# Altium schematic sheet Interface Section.SchDoc
size A3
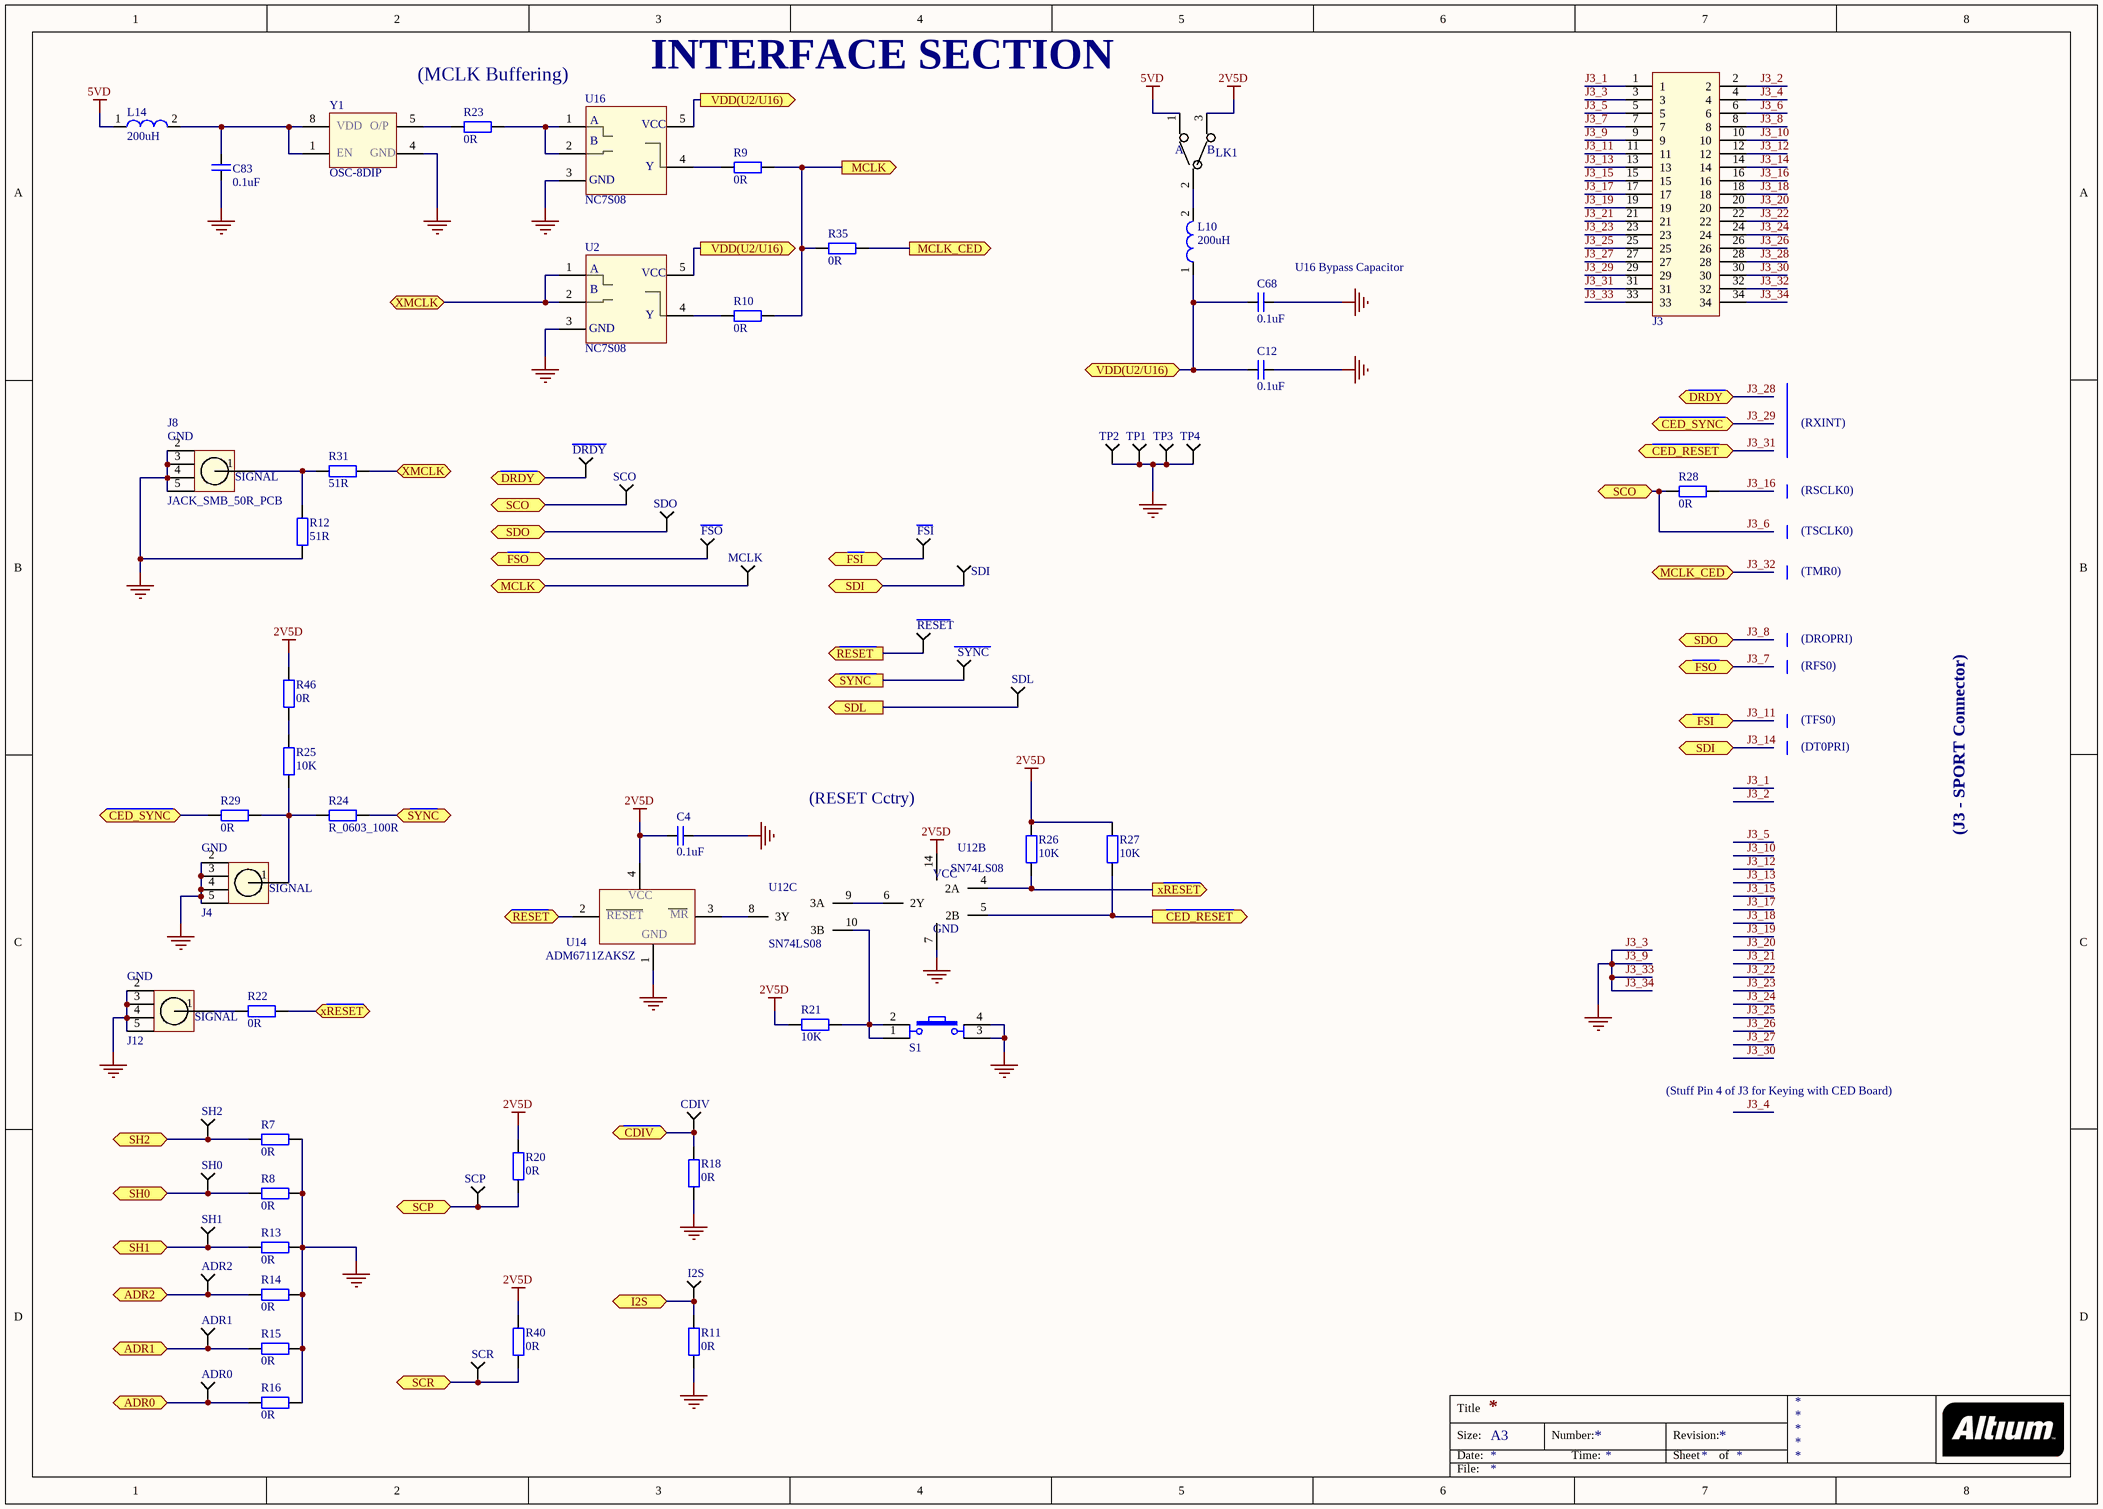
[diagram p0: Interface Section.SchDoc]

## Parts
ADR0  Test point  [Test Point]  (value not drawn)
ADR1  Test point  [Test Point]  (value not drawn)
ADR2  Test point  [Test Point]  (value not drawn)
C4  0.1uF  [C0603]
C12  0.1uF  [C0603]
C68  0.1uF  [C0603]
C83  0.1uF  [C0603]
CDIV  Test point  [Test Point]  (value not drawn)
DRDY  Test point  [Test Point]  (value not drawn)
FSI  Test point  [Test Point]  (value not drawn)
FSO  Test point  [Test Point]  (value not drawn)
I2S  Test point  [Test Point]  (value not drawn)
J3  Female Header 17x2  [FM_Header_17x2_Bottom]  (value not drawn)
J4  JACK_SMB_50R_PCB  [SMB Jack Radial]  (value not drawn)
J8  JACK_SMB_50R_PCB  [SMB Jack Radial]
J12  JACK_SMB_50R_PCB  [SMB Jack Radial]  (value not drawn)
L10  200uH  [IND_0603]
L14  200uH  [IND_0603]
LK1  HEADER_3PIN_SIL  [M_Header_3]  (value not drawn)
MCLK  Test point  [Test Point]  (value not drawn)
R7  0R  [R_0603]
R8  0R  [R_0603]
R9  0R  [R_0603]
R10  0R  [R_0603]
R11  0R  [R_0603]
R12  51R  [R_0603]
R13  0R  [R_0603]
R14  0R  [R_0603]
R15  0R  [R_0603]
R16  0R  [R_0603]
R18  0R  [R_0603]
R20  0R  [R_0603]
R21  10K  [R_0603]
R22  0R  [R_0603]
R23  0R  [R_0603]
R24  R_0603_100R  [R_0603]
R25  10K  [R_0603]
R26  10K  [R_0603]
R27  10K  [R_0603]
R28  0R  [R_0603]
R29  0R  [R_0603]
R31  51R  [R_0603]
R35  0R  [R_0603]
R40  0R  [R_0603]
R46  0R  [R_0603]
RESET  Test point  [Test Point]  (value not drawn)
S1  B3S-1000  [B3S-1000]  (value not drawn)
SCO  Test point  [Test Point]  (value not drawn)
SCP  Test point  [Test Point]  (value not drawn)
SCR  Test point  [Test Point]  (value not drawn)
SDI  Test point  [Test Point]  (value not drawn)
SDL  Test point  [Test Point]  (value not drawn)
SDO  Test point  [Test Point]  (value not drawn)
SH0  Test point  [Test Point]  (value not drawn)
SH1  Test point  [Test Point]  (value not drawn)
SH2  Test point  [Test Point]  (value not drawn)
SYNC  Test point  [Test Point]  (value not drawn)
TP1  Test point  [Test Point]  (value not drawn)
TP2  Test point  [Test Point]  (value not drawn)
TP3  Test point  [Test Point]  (value not drawn)
TP4  Test point  [Test Point]  (value not drawn)
U2  NC7S08  [SOT23-5]
U12  SN74LS08  [TSSOP-14]  (parts B,C of 4)
U14  ADM6711ZAKSZ  [SC70-4]
U16  NC7S08  [SOT23-5]
Y1  OSC-8DIP  [MXO45HS40M]

## Ports
ADR0 (bidir), ADR1 (bidir), ADR2 (bidir), CDIV (bidir), CED_RESET (bidir), CED_RESET (out), CED_SYNC (bidir), DRDY (bidir), FSI (bidir), FSO (bidir), I2S (bidir), MCLK (bidir), MCLK (out), MCLK_CED (bidir), MCLK_CED (out), RESET (bidir), RESET (out), SCO (bidir), SCP (bidir), SCR (bidir), SDI (bidir), SDL (out), SDO (bidir), SH0 (bidir), SH1 (bidir), SH2 (bidir), SYNC (bidir), SYNC (out), VDD(U2/U16) (bidir), VDD(U2/U16) (out), XMCLK (bidir), xRESET (bidir), xRESET (out)

## Nets
2V5D: C4.1 LK1.3 R20.2 R21.1 R26.2 R27.2 R40.2 R46.2 U12.14(VCC) U14.4(RESET)
5VD: L14.1 LK1.1
J3_3: C4.2 C12.2 C68.2 C83.1 J3.3 J3.9 J3.33 J3.34 J4.2 J4.3 J4.4 J4.5 J8.2 J8.3 J8.4 J8.5 J12.2 J12.3 J12.4 J12.5 R7.2 R8.2 R11.1 R12.1 R13.2 R14.2 R15.2 R16.2 R18.1 S1.3 S1.4 TP1.1 TP2.1 TP3.1 TP4.1 U2.3(GND) U12.7(GND) U14.1(GND) U16.3(GND) Y1.4(GND)  [also labelled J3_33, J3_34, J3_9]
ADR0: ADR0.1 R16.1 ; port ADR0
ADR1: ADR1.1 R15.1 ; port ADR1
ADR2: ADR2.1 R14.1 ; port ADR2
CDIV: CDIV.1 R18.2 ; port CDIV
I2S: I2S.1 R11.2 ; port I2S
J3_1: J3.1
J3_2: J3.2
J3_4: J3.4
J3_5: J3.5
J3_6: J3.6 R28.1 SCO.1 ; port SCO
J3_7: FSO.1 J3.7 ; port FSO
J3_8: J3.8 SDO.1 ; port SDO
J3_10: J3.10
J3_11: FSI.1 J3.11 ; port FSI
J3_12: J3.12
J3_13: J3.13
J3_14: J3.14 SDI.1 ; port SDI
J3_15: J3.15
J3_16: J3.16 R28.2
J3_17: J3.17
J3_18: J3.18
J3_19: J3.19
J3_20: J3.20
J3_21: J3.21
J3_22: J3.22
J3_23: J3.23
J3_24: J3.24
J3_25: J3.25
J3_26: J3.26
J3_27: J3.27
J3_28: DRDY.1 J3.28 ; port DRDY
J3_29: J3.29 R29.2 ; port CED_SYNC
J3_30: J3.30
J3_31: J3.31 R27.1 U12.5(2B) ; port CED_RESET
J3_32: J3.32 R35.2 ; port MCLK_CED
MCLK: MCLK.1 R9.2 R10.2 R35.1 ; port MCLK
RESET: RESET.1 U14.2(RESET) ; port RESET
SCP: R20.1 SCP.1 ; port SCP
SCR: R40.1 SCR.1 ; port SCR
SDL: SDL.1 ; port SDL
SH0: R8.1 SH0.1 ; port SH0
SH1: R13.1 SH1.1 ; port SH1
SH2: R7.1 SH2.1 ; port SH2
SYNC: R24.2 SYNC.1 ; port SYNC
VDD(U2/U16): C12.1 C68.1 L10.1 U2.5(VCC) U16.5(VCC) ; port VDD(U2/U16)
XMCLK: R31.2 U2.1(A) U2.2(B) ; port XMCLK
xRESET: R22.2 R26.1 U12.4(2A) ; port xRESET
NetC83_2: C83.2 L14.2 Y1.1(EN) Y1.8(VDD)
NetJ4_1: J4.1 R24.1 R25.1 R29.1
NetJ8_1: J8.1 R12.2 R31.1
NetJ12_1: J12.1 R22.1
NetL10_2: L10.2 LK1.2(SEL)
NetR9_1: R9.1 U16.4(Y)
NetR10_1: R10.1 U2.4(Y)
NetR21_2: R21.2 S1.1 S1.2 U12.10(3B)
NetR23_1: R23.1 Y1.5(O/P)
NetR23_2: R23.2 U16.1(A) U16.2(B)
NetR25_2: R25.2 R46.1
NetU12_6: U12.6(2Y) U12.9(3A)
NetU12_8: U12.8(3Y) U14.3(MR)

## Notes on the sheet
- (MCLK Buffering)
- INTERFACE SECTION
- (near C68) U16 Bypass Capacitor
- (RXINT)
- (RSCLK0)
- (TSCLK0)
- (TMR0)
- (DROPRI)
- (RFS0)
- (TFS0)
- (DT0PRI)
- (RESET Cctry)
- (J3 - SPORT Connector)
- (Stuff Pin 4 of J3 for Keying with CED Board)
- Title
- Size:
- Date:
- A3
- Number:
- Time:
- Revision:
- Sheet
- of
- File:
- (in symbol ADM6711) VCC
- (in symbol HEADER_3PIN_SIL) A; B
- (in symbol JACK_SMB_50R_PCB) GND; SIGNAL

## Library data of the parts
ADR0-ADR2 CDIV DRDY FSI FSO I2S MCLK RESET SCO SCP SCR SDI SDL SDO SH0-SH2 SYNC TP1-TP4 = Testpoint_PIN: CONN HEADER VERT .100 1POS 30AU; Manufacturer: TE Connectivity AMP Connectors; Manufacturer Part Number: 87220-1; Connector Type: Header, Unshrouded; Number of Positions: 1; Number of Positions Loaded: All; Pitch: 0.100" (2.54mm); Supplier 1: Digi-Key; RoHS: RoHS Compliant; Category: Connectors, Interconnects; Stock 1: 0; Pricing 1: 1=1.1, 25=1.04, 50=0.979, 100=0.847, 500=0.78, 1000=0.611, 2500=0.585 (USD); Packaging: Bulk; Contact Type: Male Pin; Number of Rows: 1; Row Spacing: -; Contact Mating Length: 0.318" (8.08mm); Mounting Type: Through Hole; Termination: Solder; Fastening Type: -; Features: -; Contact Finish: Gold; Contact Finish Thickness: 30µin (0.76µm); Color: Black; ComponentLink1URL: http://www.te.com/commerce/DocumentDelivery/DDEController?Action=srchrtrv&DocNm=87220&DocType=Customer+Drawing&DocLang=English; ComponentLink1Description: http://www.te.com/commerce/DocumentDelivery/DDEController?Action=srchrtrv&DocNm=87220&DocType=Customer+Drawing&DocLang=English; Supplier Part Number 1: A26540-ND
C4 C12 C68 C83 = C_0603_0.1uF: Ceramic Capacitor, 0.1 µF, ± 10%, X7R, 16 V, 0603; Manufacturer: MULTICOMP; Manufacturer Part Number: MCB0603R104KCT; Value: 0.1uF/16V; Supplier 1: Farnell; RoHS: YES; Stock 1: 797824; Pricing 1: 10=0.0551, 100=0.0404, 500=0.0279, 1000=0.0189, 4000=0.0141, 8000=0.0131 (GBP); ComponentLink1URL: http://www.farnell.com/datasheets/1723231.pdf; ComponentLink1Description: http://www.farnell.com/datasheets/1723231.pdf; Supplier Part Number 1: 9406140; ComponentLink2URL: http://www.farnell.com/cad/1558882.zip; ComponentLink2Description: http://www.farnell.com/cad/1558882.zip
J3 = Female header 17x2: 34pin 2.54mm DIL Vertical PC Tail Socket; Manufacturer: Harwin; Manufacturer Part Number: M20-7831746; Number of Positions: 34 Position; Supplier 1: Mouser; RoHS: RoHS Compliant; Category: Headers & Wire Housings; Stock 1: 0; Pricing 1: 5005=2.12 (AUD); Contact Plating: Tin; Number of Rows: 2 Row; Product: Headers; Series: M20; Termination Style: Through Hole; Type: Socket Assembly; Brand: Harwin; Mounting Style: -; Pitch: 2.54 mm; Contact Gender: Socket (Female); Product Category: 2.54mm M20 PC Tail Connectors; Standard Pack Qty: 13; RoHS - Mouser: Y; Minimum Order Quantity: 5005; Reeling: False; ComponentLink1URL: http://www.mouser.com/ds/2/181/M20-783-351164.pdf; ComponentLink1Description: http://www.mouser.com/ds/2/181/M20-783-351164.pdf; Supplier Part Number 1: 855-M20-7831746
J4 J8 J12 = JACK_SMB_50R_PCB: CONN SMB JACK STR 50 OHM PCB; Manufacturer: RADIALL; Manufacturer Part Number: R114426000; Connector Type: SMB Coaxial; Connector Body Style: Straight Jack; Coaxial Termination: Solder; Impedance: 50; Frequency Max: 4; Body Plating: Gold; Connector Mounting Orientation: PC Board; Insulation Resistance: 1000; No. of Mating Cycles: 500; Withstand Voltage: 700; Supplier 1: Farnell; RoHS: YES; Stock 1: 4581; Pricing 1: 1=2.13, 10=1.85, 25=1.8, 50=1.34 (GBP); Coaxial Cable Types: -; Contact Material: Beryllium Copper; Contact Plating: Gold; Connector Mounting: PCB; Material: Brass; Mounting Type: PCB Through Hole; Operating Frequency Max: 4; Operating Temperature Max: 165; Operating Temperature Min: -65; Termination Method: Solder; Voltage Rating V AC: 500; ComponentLink1URL: http://www.farnell.com/datasheets/32183.pdf; ComponentLink1Description: http://www.farnell.com/datasheets/32183.pdf; ComponentLink2URL: http://www.farnell.com/datasheets/302770.pdf; ComponentLink2Description: http://www.farnell.com/datasheets/302770.pdf; ComponentLink3URL: http://www.farnell.com/datasheets/302211.pdf; ComponentLink3Description: http://www.farnell.com/datasheets/302211.pdf; Supplier Part Number 1: 4194512
L10 L14 = FERRITE_BEAT_200uH: FERRITE BEAD 1000 OHM 0.2A 0603; Manufacturer: Wurth Electronics Inc; Manufacturer Part Number: 74279266; Impedance @ Frequency: 1 kOhm @ 100MHz; Current Rating: 200mA; DC Resistance (DCR): 600 mOhm Max; Filter Type: Differential Mode - Single; Supplier 1: Digi-Key; RoHS: RoHS Compliant; Category: Filters; Stock 1: 36000; Pricing 1: 4000=0.1275 (USD); Packaging: Tape & Reel (TR); Package / Case: 0603 (1608 Metric); Mounting Type: Surface Mount; Height (Max): 0.039" (1.00mm); Size / Dimension: 0.063" L x 0.031" W (1.60mm x 0.80mm); ComponentLink1URL: http://katalog.we-online.de/pbs/datasheet/74279266.pdf; ComponentLink1Description: http://katalog.we-online.de/pbs/datasheet/74279266.pdf; Supplier Part Number 1: 732-4484-2-ND; Value: 200uH
LK1 = HEADER_3PIN_SIL: SIL VERTICAL PC TAIL PIN HEADER 3PIN, M20-9990345; Manufacturer: Harwin Inc; Connector Type: Header, Unshrouded, Breakaway; Number of Positions: 3; Number of Positions Loaded: All; Pitch: 0.100" (2.54mm); Supplier 1: Digi-Key; Manufacturer Part Number: M20-9990345; RoHS: RoHS Compliant; Category: Connectors, Interconnects; Stock 1: 852; Pricing 1: 1=0.16, 10=0.15, 25=0.112, 50=0.096, 100=0.0928, 250=0.08, 500=0.0768, 1000=0.0672, 2500=0.0608 (USD); Packaging: Bulk; Contact Type: Male Pin; Number of Rows: 1; Row Spacing: -; Contact Mating Length: 0.240" (6.10mm); Mounting Type: Through Hole; Termination: Solder; Fastening Type: -; Features: -; Contact Finish: Gold; Contact Finish Thickness: -; Color: Black; ComponentLink1URL: http://cdn.harwin.com/pdfs/M20-999.pdf; ComponentLink1Description: http://cdn.harwin.com/pdfs/M20-999.pdf; Supplier Part Number 1: 952-2263-ND
R7-R11 R13-R16 R18 R20 R22 R23 R28 R29 R35 R40 R46 = R_0603_0R: RES SMD 0.0 OHM JUMPER 1/16W; Manufacturer: TE Connectivity AMP Connectors; Manufacturer Part Number: 6-1622826-4; Resistance (Ohms): 0.0; Power (Watts): 0.063W, 1/16W; Value: 0R-1/16W; Supplier 1: Digi-Key; RoHS: RoHS Compliant; Category: Resistors; Stock 1: 80000; Pricing 1: 10000=0.00112, 30000=0.00099, 50000=0.0009, 100000=0.00089 (USD); Packaging: Tape & Reel (TR); Tolerance: Jumper; Composition: Thick Film; Features: -; Temperature Coefficient: -; Operating Temperature: -55°C ~ 125°C; Package / Case: 0402 (1005 Metric); Supplier Device Package: 0402; Size / Dimension: 0.039" L x 0.020" W (1.00mm x 0.50mm); Height: 0.016" (0.40mm); Number of Terminations: 2; ComponentLink1URL: http://www.te.com/commerce/DocumentDelivery/DDEController?Action=srchrtrv&DocNm=1773204&DocType=DS&DocLang=English; ComponentLink1Description: http://www.te.com/commerce/DocumentDelivery/DDEController?Action=srchrtrv&DocNm=1773204&DocType=DS&DocLang=English; Supplier Part Number 1: A106025TR-ND
R12 R31 = R_0603_51R: RES SMD 51 OHM 1% 1/16W 0603; Manufacturer: MULTICOMP; Manufacturer Part Number: MC0063W0603151R; Temperature Coefficient: ± 200; Value: 51R-1/16W; Product Range: MC Series; Resistance: 51; Power Rating: 63; Voltage Rating: 50; Resistor Case Style: 0603 [1608 Metric]; Reel Quantity: 15000; Resistor Element Material: Thick Film<!--FANDB--><div class="features-and-benefits-container"></div>; Supplier 1: Farnell; RoHS: YES; Stock 1: 0; Pricing 1: 3=1.84 (GBP); Packaging: Tape & Reel; ComponentLink1URL: http://www.farnell.com/datasheets/1729046.pdf; ComponentLink1Description: http://www.farnell.com/datasheets/1729046.pdf; Supplier Part Number 1: 2357526; Resistance Tolerance: ± 1%; MSL: -
R21 R25-R27 = R_0603_10K: RES SMD 10K OHM 1% 1/16W 0603; Manufacturer: MULTICOMP; Manufacturer Part Number: MC0063W0603110K; Temperature Coefficient: ± 100; Value: 10K-1/16W; Product Range: MC Series; Resistance: 10; Power Rating: 63; Voltage Rating: 50; Resistor Case Style: 0603 [1608 Metric]; Reel Quantity: 15000; Resistor Element Material: Thick Film<!--FANDB--><div class="features-and-benefits-container"></div>; Supplier 1: Farnell; RoHS: YES; Pricing 1: 3=1.84 (GBP); Packaging: Tape & Reel; ComponentLink1URL: http://www.farnell.com/datasheets/1729046.pdf; ComponentLink1Description: http://www.farnell.com/datasheets/1729046.pdf; Supplier Part Number 1: 2357594; Resistance Tolerance: ± 1%; MSL: -; ComponentLink2URL: http://www.farnell.com/datasheets/1851159.pdf; ComponentLink2Description: http://www.farnell.com/datasheets/1851159.pdf
R24 = R_0603_100R: RES SMD 100 OHM 1% 1/10W 0603; Manufacturer: Yageo; Manufacturer Part Number: RC0603FR-07100RL; Resistance (Ohms): 100; Power (Watts): 0.1W, 1/10W; Temperature Coefficient: ±100ppm/°C; Supplier 1: Digi-Key; RoHS: RoHS Compliant; Category: Resistors; Stock 1: 1487098; Pricing 1: 1=0.1, 10=0.014, 25=0.01, 100=0.0057, 250=0.00436, 500=0.00348, 1000=0.00257, 2500=0.00223 (USD); Packaging: Cut Tape (CT); Tolerance: ±1%; Composition: Thick Film; Features: Moisture Resistant; Operating Temperature: -55°C ~ 155°C; Package / Case: 0603 (1608 Metric); Supplier Device Package: 0603; Size / Dimension: 0.063" L x 0.031" W (1.60mm x 0.80mm); Height: 0.022" (0.55mm); Number of Terminations: 2; ComponentLink1URL: http://www.yageo.com/NewPortal/yageodocoutput?fileName=/pdf/R-Chip/PYu-RC_Group_51_RoHS_L_3.pdf; ComponentLink1Description: http://www.yageo.com/NewPortal/yageodocoutput?fileName=/pdf/R-Chip/PYu-RC_Group_51_RoHS_L_3.pdf; Supplier Part Number 1: 311-100HRCT-ND
S1 = PUSH_BUTTON_SWITCH: SWITCH TACTILE SPST-NO 0.05A 24V; Manufacturer: Omron Electronics Inc-EMC Div; Switch Function: Off-Mom; Contact Rating @ Voltage: 0.05A @ 24VDC; Actuator Type: Standard; Actuator Height off PCB, from Pins: 4.30mm; Actuator Orientation: Top Actuated; Outline: 6.60mm x 6.00mm; Illumination: Non-Illuminated; Operating Force: 160gf; Ingress Protection: IP67 - Dust Tight, Waterproof; Switch Travel: 0.25mm; Mechanical Life: 500,000 Cycles; Supplier 1: Digi-Key; Manufacturer Part Number: B3S-1000; RoHS: RoHS Compliant; Category: Switches; Stock 1: 9953; Pricing 1: 1=0.76, 10=0.731, 25=0.6896, 50=0.607, 100=0.5518, 250=0.5242, 500=0.51042, 1000=0.40006 (USD); Packaging: Bulk; Circuit: SPST-NO; Mounting Type: Surface Mount; Termination Style: Gull Wing; Illumination Voltage (Nominal): -; Illumination Type, Color: -; Features: Sealed - Fully; Actuator Material: -; Operating Temperature: -25°C ~ 70°C; ComponentLink1URL: http://www.components.omron.com/components/web/PDFLIB.nsf/0/B13BA5F043DAF4D785257201007DD671/$file/B3S_1110.pdf; ComponentLink1Description: http://www.components.omron.com/components/web/PDFLIB.nsf/0/B13BA5F043DAF4D785257201007DD671/$file/B3S_1110.pdf
U2 U16 = NC7S08: IC GATE AND 1CH 2-INP SOT-23-5; Manufacturer: Fairchild Semiconductor; Manufacturer Part Number: NC7SZ08M5; Logic Type: AND Gate; Number of Circuits: 1; Number of Inputs: 2; Voltage - Supply: 1.65 V ~ 5.5 V; Current - Quiescent (Max): 2µA; Current - Output High, Low: 32mA, 32mA; Max Propagation Delay @ V, Max CL: 4.5ns @ 5V, 50pF; Supplier 1: Digi-Key; RoHS: RoHS Compliant; Category: Integrated Circuits (ICs); Stock 1: 1903; Pricing 1: 1=0.59, 10=0.494, 25=0.4332, 100=0.3708 (USD); Packaging: Cut Tape (CT); Features: -; Logic Level - Low: -; Logic Level - High: -; Operating Temperature: -40°C ~ 85°C; Mounting Type: Surface Mount; Supplier Device Package: SOT-23-5; Package / Case: SC-74A, SOT-753; ComponentLink1URL: http://www.fairchildsemi.com/datasheets/NC/NC7SZ08.pdf; ComponentLink1Description: http://www.fairchildsemi.com/datasheets/NC/NC7SZ08.pdf; Supplier Part Number 1: NC7SZ08M5CT-ND
U12 = 74LS08: IC GATE AND 4CH 2-INP 14-TSSOP; Manufacturer: Texas Instruments; Manufacturer Part Number: SN74LVC08APWR; Logic Type: AND Gate; Number of Circuits: 4; Number of Inputs: 2; Voltage - Supply: 1.65 V ~ 3.6 V; Current - Quiescent (Max): 1µA; Current - Output High, Low: 24mA, 24mA; Logic Level - Low: 0.7 V ~ 0.8 V; Logic Level - High: 1.7 V ~ 2 V; Max Propagation Delay @ V, Max CL: 3.9ns @ 3.3V, 50pF; Supplier 1: Digi-Key; RoHS: RoHS Compliant; Category: Integrated Circuits (ICs); Stock 1: 4665; Pricing 1: 1=0.42, 10=0.288, 100=0.134, 1000=0.117 (USD); Packaging: Cut Tape (CT); Features: -; Operating Temperature: -40°C ~ 125°C; Mounting Type: Surface Mount; Supplier Device Package: 14-TSSOP; Package / Case: 14-TSSOP (0.173", 4.40mm Width); ComponentLink1URL: http://www.ti.com/lit/ds/symlink/sn74lvc08a.pdf; ComponentLink1Description: http://www.ti.com/lit/ds/symlink/sn74lvc08a.pdf; Supplier Part Number 1: 296-1221-1-ND
U14 = ADM6711: IC SUPERVISOR MPU 2.32V SC70-4; Manufacturer: Analog Devices Inc; Manufacturer Part Number: ADM6711ZAKSZ-REEL7; Number of Voltages Monitored: 1; Output: Push-Pull, Totem Pole; Reset: Active Low; Reset Timeout: 140 ms Minimum; Supplier 1: Digi-Key; RoHS: RoHS Compliant; Category: Integrated Circuits (ICs); Stock 1: 2357; Pricing 1: 1=0.89, 10=0.788, 25=0.7112, 100=0.6224, 250=0.54588, 500=0.48412, 1000=0.38285 (USD); Packaging: Cut Tape (CT); Type: Simple Reset/Power-On Reset; Voltage - Threshold: 2.32V; Operating Temperature: -40°C ~ 125°C; Mounting Type: Surface Mount; Package / Case: SC-82A, SOT-343; Supplier Device Package: SC-70-4; ComponentLink1URL: http://www.analog.com/media/en/technical-documentation/data-sheets/ADM6711_6713.pdf; ComponentLink1Description: http://www.analog.com/media/en/technical-documentation/data-sheets/ADM6711_6713.pdf; Supplier Part Number 1: ADM6711ZAKSZ-REEL7CT-ND
Y1 = OSC-8DIP: OSC XO 40.000MHZ HCMOS TTL PIN; Manufacturer: CTS-Frequency Controls; Manufacturer Part Number: MXO45HS-2C-40M0000; Frequency: 40MHz; Output: HCMOS, TTL; Voltage - Supply: 5V; Frequency Stability: ±100ppm; Current - Supply (Max): 40mA; Current - Supply (Disable) (Max): 10µA; Supplier 1: Digi-Key; RoHS: RoHS Compliant; Category: Crystals and Oscillators; Stock 1: 1254; Pricing 1: 1=2.07, 10=1.978, 50=1.932, 100=1.656, 500=1.61, 750=1.472, 1000=1.357, 2500=1.288, 5000=1.242 (USD); Packaging: Tray; Type: XO (Standard); Function: -; Operating Temperature: -20°C ~ 70°C; Ratings: -; Mounting Type: Through Hole; Size / Dimension: 0.520" L x 0.520" W (13.20mm x 13.20mm); Height: 0.217" (5.50mm); Package / Case: 8-DIP, 4 Leads (Half Size, Metal Can); ComponentLink1URL: http://www.ctscorp.com/components/Datasheets/008-0258-0.pdf; ComponentLink1Description: http://www.ctscorp.com/components/Datasheets/008-0258-0.pdf; Supplier Part Number 1: CTX175-ND